# EasyEDA Pro project ProPrj_MotorHall.epro

# Schematic Schematic1
Board Name: Board1; Create Date: 2024-10-31; Page Name: P1; Project Name: MotorHall; Schematic Name: Schematic1; Update Date: 2024-10-31; Company: 嘉立创EDA; Page Size: A4; Version: V1.0
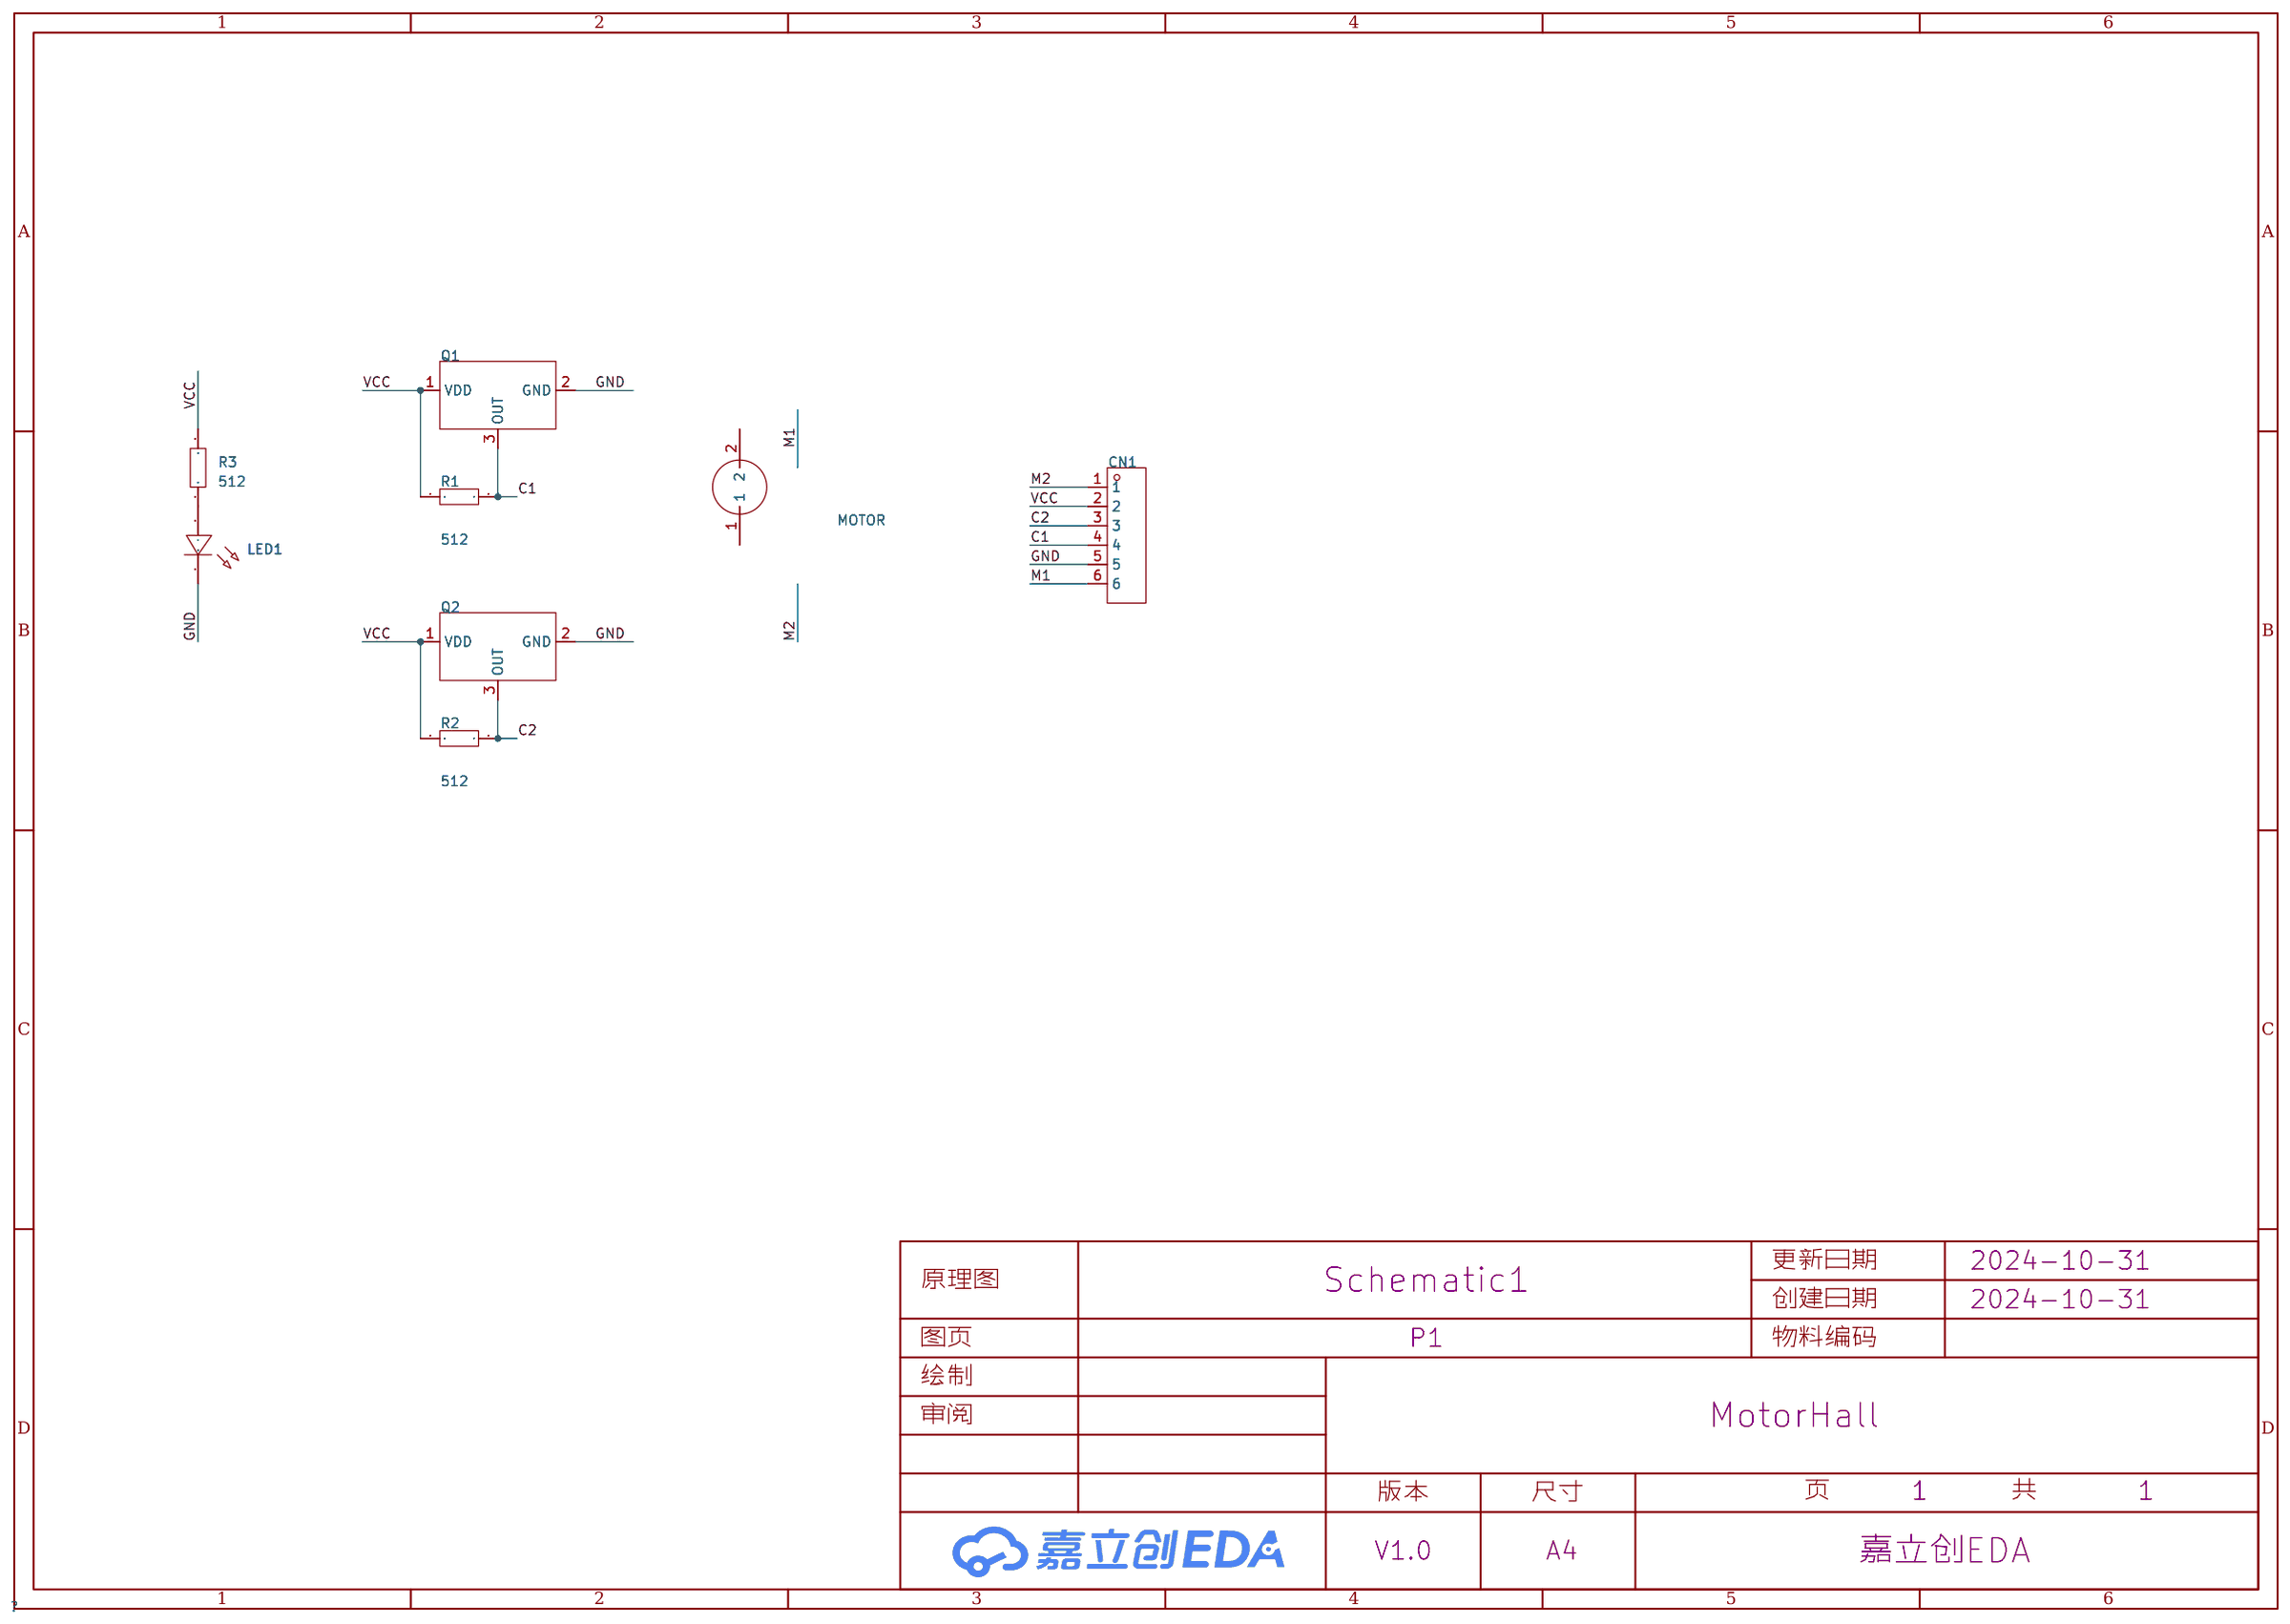
[diagram p0: schematic sheet]

## Parts
CN1  HC-1.25-6AW  [CONN-TH_6P-P1.25_HCTL_HC-1.25-6AW]
LED1  -  [LED_0603]
MOTOR  -  [N20电机座]
Q1  US1881KUA-AAA-000-BU  [TO-92-3_L4.1-W1.6-P1.27-L]
Q2  US1881KUA-AAA-000-BU  [TO-92-3_L4.1-W1.6-P1.27-L]
R1  512  [R0603]
R2  512  [R0603]
R3  512  [R0603]

## Library data of the parts
CN1 = HC-1.25-6AW: 插针结构:1x6P;间距:1.25mm;安装方式:弯插;参考系列:-;总PIN数:6P;排数:1;每排PIN数:6;行距:-;额定电流:1A;触头材质:黄铜;触头镀层:锡;工作温度范围:-25℃~+85℃;; LCSC Part Name: 1x6P 间距:1.25mm 弯插; Supplier Part: C2845539; Manufacturer: HCTL(华灿天禄); Supplier Footprint: 弯插,P=1.25mm; JLCPCB Part Class: 扩展库; Datasheet: https://atta.szlcsc.com/upload/public/pdf/source/20230707/04F6BEA69F699E7BB6558EF06AF1DC24.pdf; Supplier: LCSC; Pins Structure: 1x6P; Pitch: 1.25mm; Mounting Style: 弯插; Number of Pins: 6P; Number of Rows: 1; Number of PINs Per Row: 6; Current Rating (Max): 1A; Contact Material: 黄铜; Contact Plating: 锡; Operating Temperature Range: -25℃~+85℃
LED1 = LED_0603-B: Supplier Footprint: 0603
MOTOR = N20电机
Q1 Q2 = US1881KUA-AAA-000-BU: 工作点(Gs):95Gs;释放点(Gs):-95Gs;; Supplier Part: C17199063; Manufacturer: Melexis(比利时迈来芯); Supplier Footprint: TO-92-3; JLCPCB Part Class: 扩展库; Datasheet: https://atta.szlcsc.com/upload/public/pdf/source/20210430/5B613BCA688C7C562539A6C7AF24464E.pdf; Supplier: LCSC; supply voltage: 3.5V~24V; Operation Points: 95Gs; Release Points: -95Gs; Operating Temperature: -40℃~+125℃
R1-R3 = Res_0603: Supplier Footprint: 0603

## Nets
GND: CN1.5 LED1.1(C) Q1.2(GND) Q2.2(GND)
VCC: CN1.2 Q1.1(VDD) Q2.1(VDD) R1.1 R2.1 R3.2
C1: CN1.4 Q1.3(OUT) R1.2
C2: CN1.3 Q2.3(OUT) R2.2
M1: CN1.6
M2: CN1.1
$1N567: LED1.2(A) R3.1

Not connected (* = marked no-connect by the designer): MOTOR 1 2

# Schematic Schematic2
Board Name: V2; Create Date: 2024-11-01; Page Name: P1; Project Name: MotorHall; Schematic Name: Schematic2; Update Date: 2024-11-04; Company: 嘉立创EDA; Page Size: A4; Version: V1.0
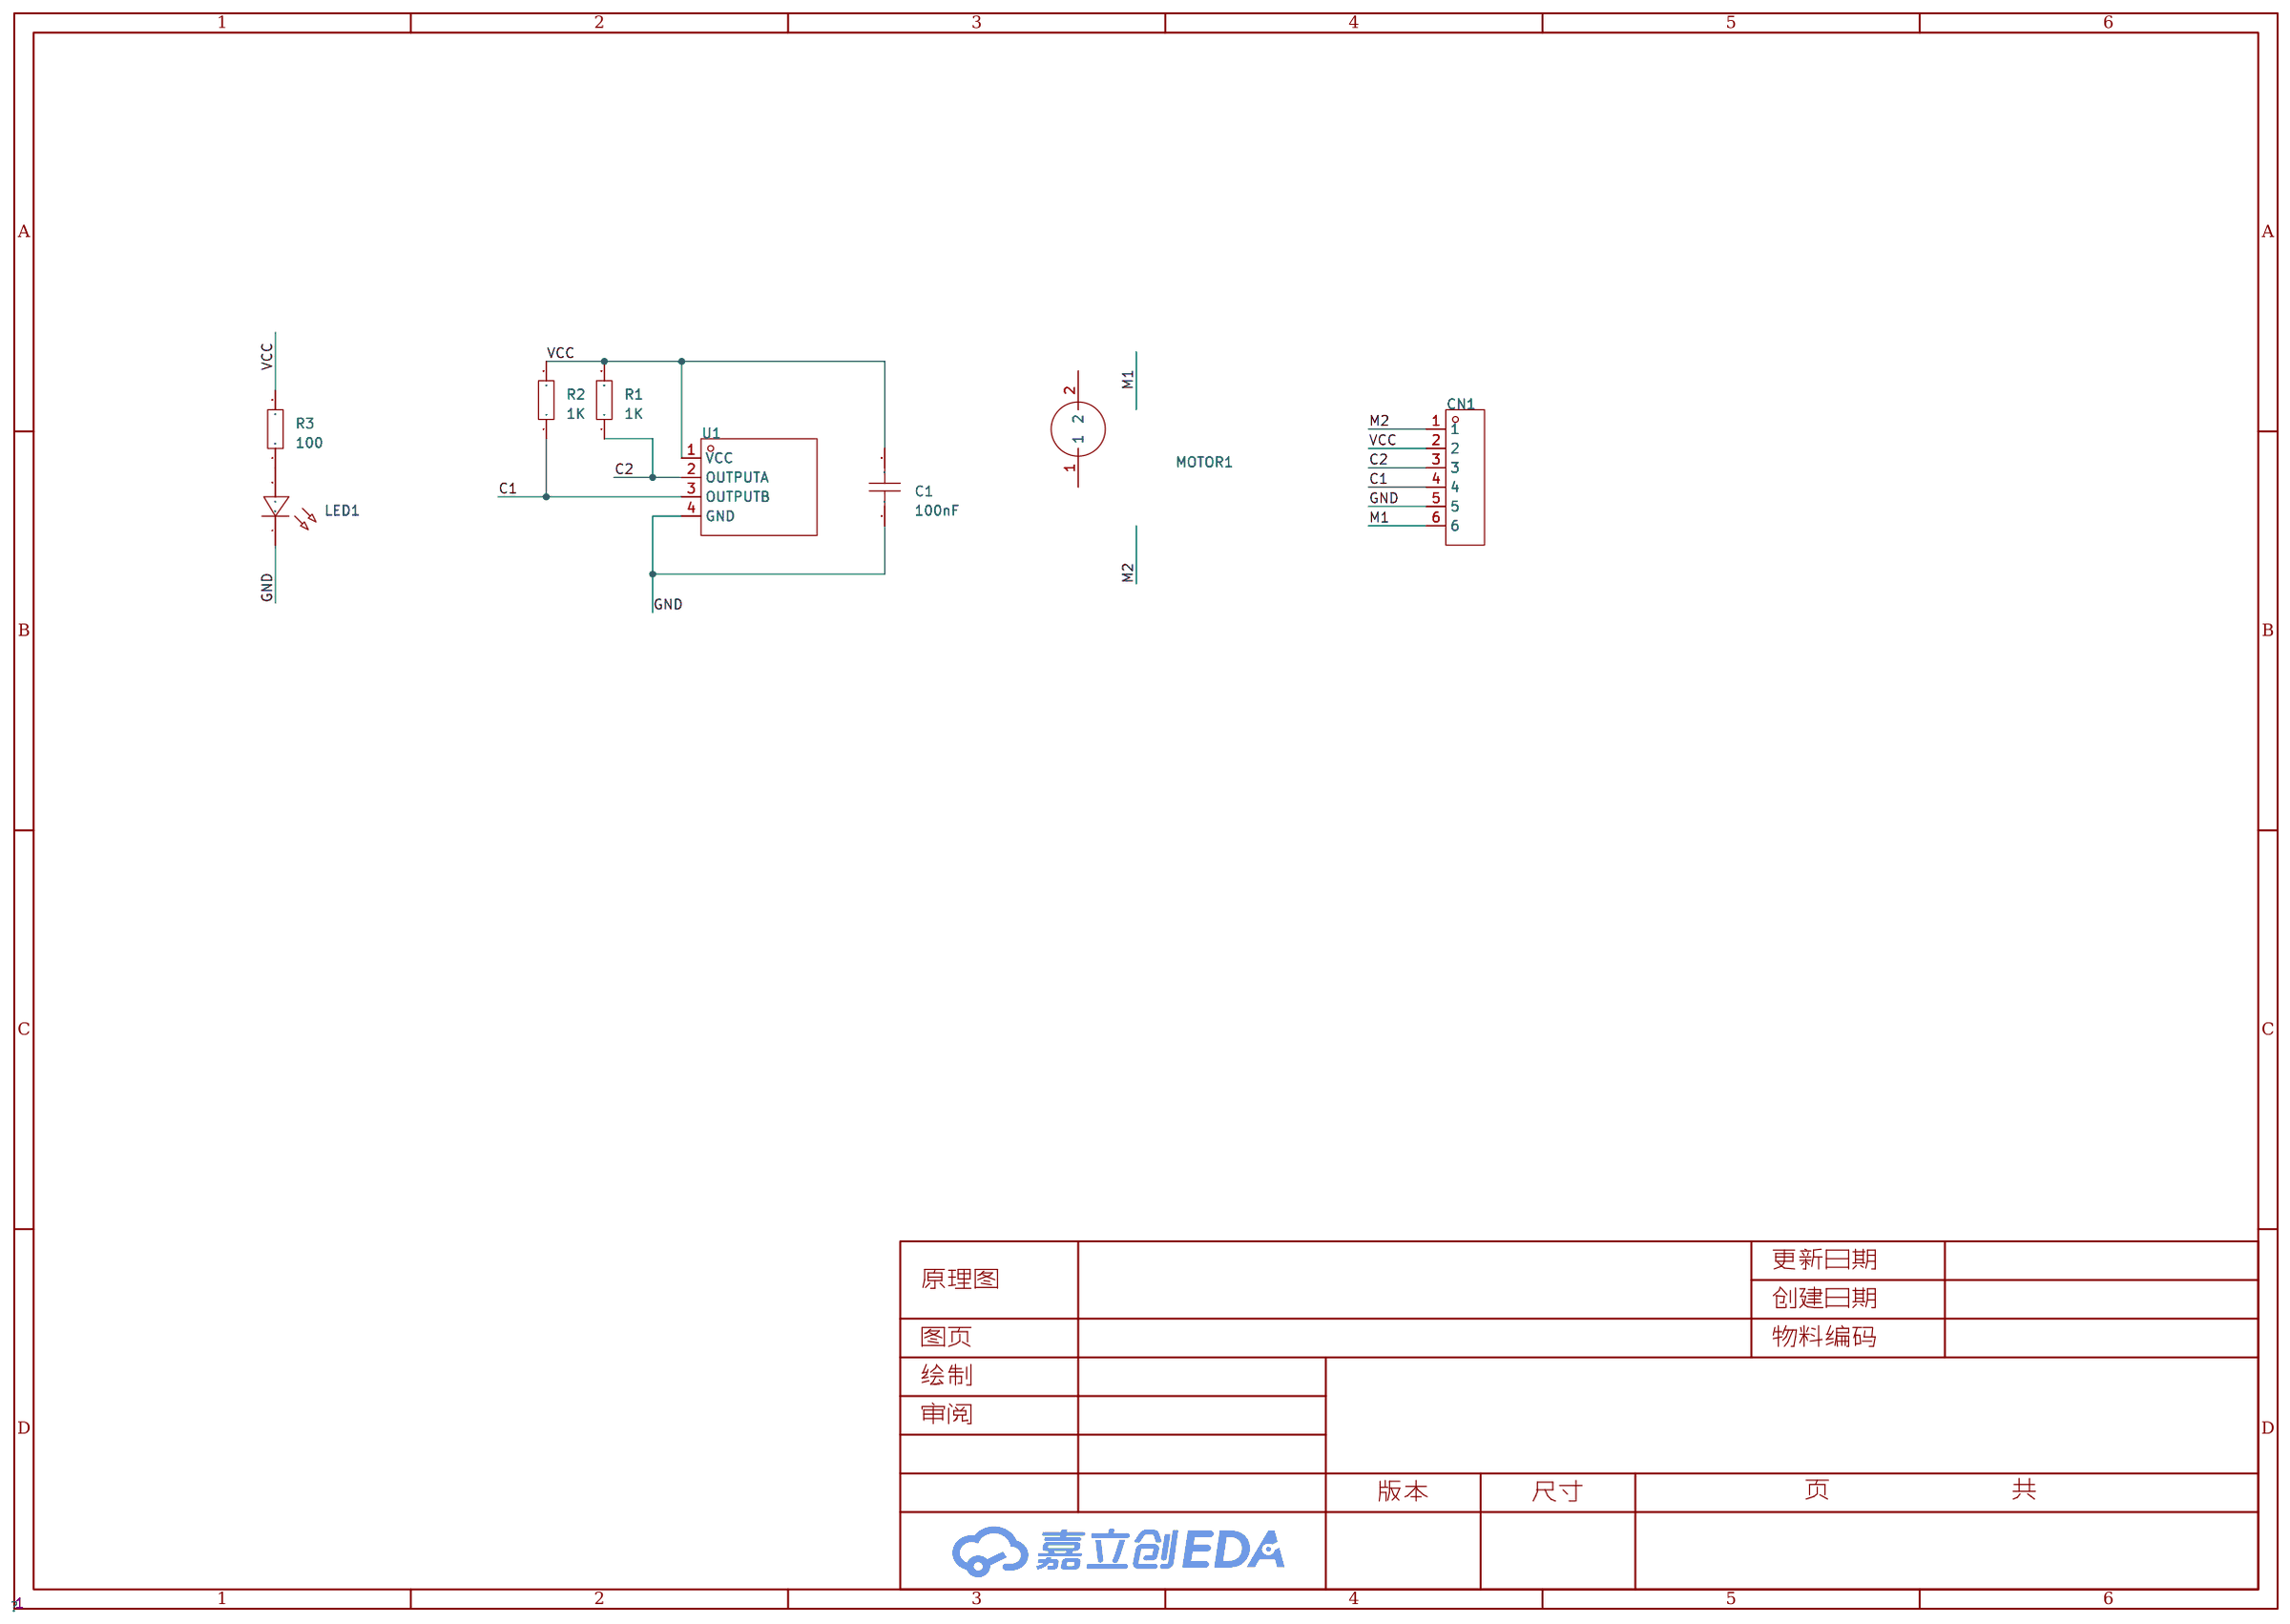
[diagram p1: schematic sheet]

## Parts
C1  100nF  [C0603]
CN1  HC-1.25-6AW  [CONN-TH_6P-P1.25_HCTL_HC-1.25-6AW]
LED1  -  [LED_0603]
MOTOR1  -  [N20电机座]
R1  1K  [R0603]
R2  1K  [R0603]
R3  100  [R0603]
U1  A1230LK-T  [SIP-4_L5.3-W1.6-P1.27-L]

## Library data of the parts
C1 = CAP_0603: Supplier Footprint: 0603
CN1 = HC-1.25-6AW: 插针结构:1x6P;间距:1.25mm;安装方式:弯插;参考系列:-;总PIN数:6P;排数:1;每排PIN数:6;行距:-;额定电流:1A;触头材质:黄铜;触头镀层:锡;工作温度范围:-25℃~+85℃;; LCSC Part Name: 1x6P 间距:1.25mm 弯插; Supplier Part: C2845539; Manufacturer: HCTL(华灿天禄); Supplier Footprint: 弯插,P=1.25mm; JLCPCB Part Class: 扩展库; Datasheet: https://atta.szlcsc.com/upload/public/pdf/source/20230707/04F6BEA69F699E7BB6558EF06AF1DC24.pdf; Supplier: LCSC; Pins Structure: 1x6P; Pitch: 1.25mm; Mounting Style: 弯插; Number of Pins: 6P; Number of Rows: 1; Number of PINs Per Row: 6; Current Rating (Max): 1A; Contact Material: 黄铜; Contact Plating: 锡; Operating Temperature Range: -25℃~+85℃
LED1 = LED_0603-B: Supplier Footprint: 0603
MOTOR1 = N20电机
R1-R3 = Res_0603: Supplier Footprint: 0603
U1 = A1230LK-T: 工作点(Gs):30Gs;释放点(Gs):-30Gs;; LCSC Part Name: 霍尔效应开关; Supplier Part: C696500; Manufacturer: ALLEGRO(美国埃戈罗); Supplier Footprint: SIP-4; JLCPCB Part Class: 扩展库; Datasheet: https://atta.szlcsc.com/upload/public/pdf/source/20200706/C696500_0E6C849013AAD831CBB5913B844409D4.pdf; Supplier: LCSC; supply voltage: 3.3V~18V; Operation Points: 30Gs; Release Points: -30Gs; Operating Temperature: -40℃~+150℃

## Nets
GND: C1.1 CN1.5 LED1.1(C) U1.4(GND)
VCC: C1.2 CN1.2 R1.2 R2.2 R3.2 U1.1(VCC)
C1: CN1.4 R2.1 U1.3(OUTPUTB)
C2: CN1.3 R1.1 U1.2(OUTPUTA)
M1: CN1.6
M2: CN1.1
$1N393: LED1.2(A) R3.1

Not connected (* = marked no-connect by the designer): MOTOR1 1 2

# Board PCB1
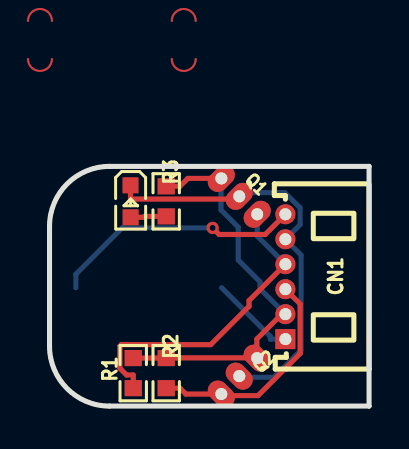
[diagram p2: board, top side]
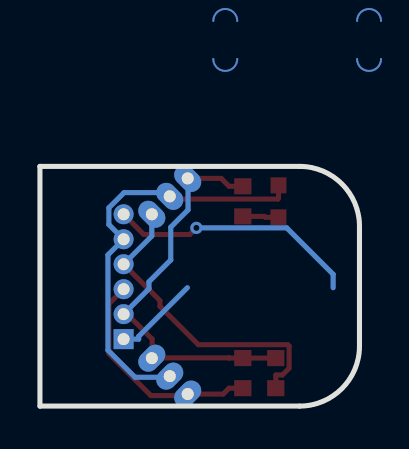
[diagram p3: board, bottom side, seen from below]

Outline 16 x 12 mm; copper layers: Top Layer, Bottom Layer. Coordinates in mm from the lower left corner of the outline.
Outline path: 0,9 0,3 arc(0.88,0.88) 3,0 16,0 16,12 3,12 arc(0.88,11.12) 0,9
Stack: Top Layer 0.035mm / Dielectric1 1.51mm FR4 er 4.5 / Bottom Layer 0.035mm

## Design rules (mm)
template: 自定义配置
spacing copperThickness1oz (default): track to track 0.102, other pairs 0 to 0.3
spacing copperThickness2oz: track to track 0.203, other pairs 0.152 to 0.3
track width copperThickness1oz (default): min 0.127, default 0.254, max 2.54
track width copperThickness2oz: min 0.203, default 0.254, max 2.54
differential pair differentialPair (default): width min 0.127, default 0.254, max 2.54; gap min 0.152, default 0.152
via viaSize (default): diameter min 0.5, default 0.61, max 10; hole min 0.3, default 0.305, max 6.3

## Placement (name value [footprint] x y rotation side)
CN1  HC-1.25-6AW  [CONN-TH_6P-P1.25_HCTL_HC-1.25-6AW]  11.81 6.48 90 top
LED1  -  [LED_0603]  4.06 10.2 270 top
MOTOR  -  [N20电机座]  5 6 180 top
Q1  US1881KUA-AAA-000-BU  [TO-92-3_L4.1-W1.6-P1.27-L]  9.5 10.5 315 top
Q2  US1881KUA-AAA-000-BU  [TO-92-3_L4.1-W1.6-P1.27-L]  9.5 1.5 225 top
R1  512  [R0603]  4.19 1.65 270 top
R2  512  [R0603]  5.84 1.65 270 top
R3  512  [R0603]  5.84 10.25 90 top

## Footprints (pads in the part's own frame, mm; a bottom-side part is the same pattern mirrored in y, then rotated)
CONN-TH_6P-P1.25_HCTL_HC-1.25-6AW
  rect 1x1 hole 0.6: 1(-3.125,0)
  round 1 hole 0.6: 2(-1.875,0) 3(-0.625,0) 4(0.625,0) 5(1.875,0) 6(3.125,0)
LED_0603
  rect 0.8x0.8 smd: 1(-0.851,-0.01) 2(0.75,-0.005)
N20电机座
  custom 1.2x3.1 hole 0.9x2.75: 1(-1.72,-12.329) 2(5.48,-12.329)
R0603
  rect 0.806x0.864 smd: 1(-0.753,0) 2(0.753,0)
TO-92-3_L4.1-W1.6-P1.27-L
  oval 1x1.5 hole 0.6: 1(-1.27,0) 2(0,0) 3(1.27,0)

## Nets
GND: CN1.5 LED1.1 Q1.2 Q2.2
VCC: CN1.2 Q1.1 Q2.1 R1.1 R2.1 R3.2
C1: CN1.4 Q1.3 R1.2
C2: CN1.3 Q2.3 R2.2
M1: CN1.6 MOTOR.2
M2: CN1.1 MOTOR.1
$1N567: LED1.2 R3.1

## Via types
v1: diameter 0.61, hole 0.305, Top Layer to Bottom Layer, 1 via

## Routing (per net, layer and track width the routed paths; a pad name or vN(x,y) marks a point on that pad's centre or on a via; arc(x,y) is an arc through that point)
GND: length 21
  Top Layer w0.254: LED1.1 4.05,10.4 4.09,10.36 9.36,10.36 Q1.2
  Bottom Layer w0.254: Q2.2 9.56,1.44 11.24,1.44 12.6,2.8 12.6,7.57 CN1.5 12.55,9.09 12.55,9.93 11.79,10.69 9.69,10.69 Q1.2
VCC: length 20.2
  Top Layer w0.254: 4.19,2.41 6.53,2.41 6.54,2.42 10.38,2.42 ; 10.38,2.42 10.38,3.36 11.63,4.6 CN1.2 ; 10.38,2.42 10.4,2.4 ; 8.6,11.4 6.92,11.4 6.53,11 R3.2
  Bottom Layer w0.254: CN1.2 10.54,5.87 10.54,6.22 9.45,7.31 9.45,8.96 8.59,9.82 8.59,11.38 8.6,11.4
C1: length 15.8
  Top Layer w0.254: 4.19,0.9 4.19,1.56 3.86,1.56 3.52,1.89 3.52,3 3.6,3.08 8.07,3.08 9.99,5 9.99,5.28 CN1.4
  Bottom Layer w0.254: 10.4,9.6 10.4,8.51 CN1.4
C2: length 11.3
  Top Layer w0.254: CN1.3 12.55,5.12 12.55,2.63 10.44,0.53 8.68,0.53 8.6,0.6 6.82,0.6 6.53,0.9 5.84,0.9
M1: length 12.7
  Top Layer w0.254: v1(8.17,8.92) 8.49,8.59 10.8,8.59 11.81,9.6
  Bottom Layer w0.254: 1.32,5.93 1.32,6.6 3.64,8.92 v1(8.17,8.92)
M2: length 4.3
  Bottom Layer w0.254: 8.62,5.93 11.06,3.49 11.06,3.35 CN1.1
$1N567: length 1.8
  Top Layer w0.254: R3.1 4.76,9.5 4.72,9.45 4.06,9.45

# Board PCB2
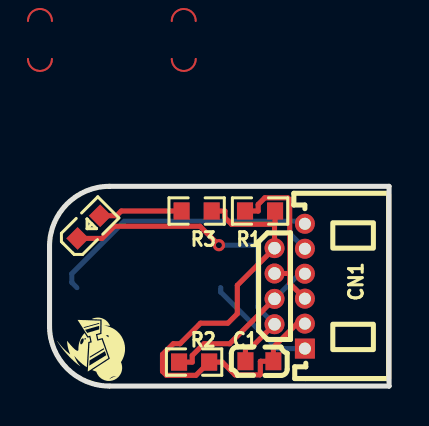
[diagram p4: board, top side]
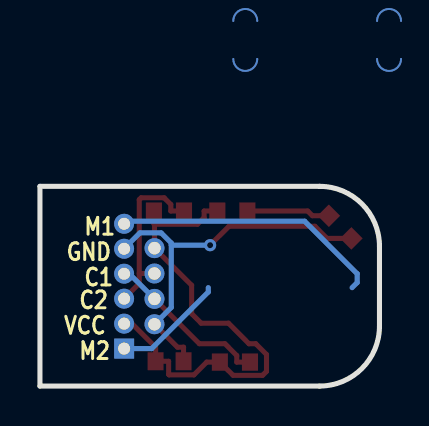
[diagram p5: board, bottom side, seen from below]

Outline 17 x 10 mm; copper layers: Top Layer, Bottom Layer. Coordinates in mm from the lower left corner of the outline.
Outline path: 0,7 arc(0.88,9.12) 3,10 17,10 17,0 3,0 arc(0.88,0.88) 0,3 0,7
Stack: Top Layer 0.035mm / Dielectric1 1.51mm FR4 er 4.5 / Bottom Layer 0.035mm

## Design rules (mm)
template: 自定义配置
spacing copperThickness1oz (default): track to track 0.102, other pairs 0.102 to 0.3
spacing copperThickness2oz: track to track 0.203, other pairs 0.152 to 0.3
track width copperThickness1oz (default): min 0.127, default 0.254, max 2.54
track width copperThickness2oz: min 0.203, default 0.254, max 2.54
differential pair differentialPair (default): width min 0.127, default 0.254, max 2.54; gap min 0.152, default 0.152
via viaSize (default): diameter min 0.5, default 0.61, max 10; hole min 0.3, default 0.305, max 6.3

## Placement (name value [footprint] x y rotation side)
C1  100nF  [C0603]  10.51 1.24 0 top
CN1  HC-1.25-6AW  [CONN-TH_6P-P1.25_HCTL_HC-1.25-6AW]  12.79 5 90 top
LED1  -  [LED_0603]  2 8 45 top
MOTOR1  -  [N20电机座]  5 5 180 top
R1  1K  [R0603]  10.54 8.76 0 top
R2  1K  [R0603]  7.24 1.2 0 top
R3  100  [R0603]  7.37 8.76 0 top
U1  A1230LK-T  [SIP-4_L5.3-W1.6-P1.27-L]  11.27 5 270 top

## Footprints (pads in the part's own frame, mm; a bottom-side part is the same pattern mirrored in y, then rotated)
C0603
  rect 0.8x0.9 smd: 1(-0.7,0) 2(0.7,0)
CONN-TH_6P-P1.25_HCTL_HC-1.25-6AW
  rect 1x1 hole 0.6: 1(-3.125,0)
  round 1 hole 0.6: 2(-1.875,0) 3(-0.625,0) 4(0.625,0) 5(1.875,0) 6(3.125,0)
LED_0603
  rect 0.8x0.8 smd: 1(-0.851,-0.01) 2(0.75,-0.005)
N20电机座
  custom 1.2x3.1 hole 0.9x2.75: 1(-1.72,-12.329) 2(5.48,-12.329)
R0603
  rect 0.806x0.864 smd: 1(-0.753,0) 2(0.753,0)
SIP-4_L5.3-W1.6-P1.27-L
  round 1 hole 0.625: 1(-1.905,0) 2(-0.635,0) 3(0.635,0) 4(1.905,0)

## Nets
GND: C1.1 CN1.5 LED1.1 U1.4
VCC: C1.2 CN1.2 R1.2 R2.2 R3.2 U1.1
C1: CN1.4 R2.1 U1.3
C2: CN1.3 R1.1 U1.2
M1: CN1.6 MOTOR1.2
M2: CN1.1 MOTOR1.1
$1N393: LED1.2 R3.1

## Via types
v1: diameter 0.61, hole 0.305, Top Layer to Bottom Layer, 1 via

## Routing (per net, layer and track width the routed paths; a pad name or vN(x,y) marks a point on that pad's centre or on a via; arc(x,y) is an arc through that point)
GND: length 19.6
  Top Layer w0.254: 11.26,3.1 10.11,1.95 9.81,1.95 9.81,1.24 ; v1(8.48,7.05) 7.53,8 3.23,8 2.62,7.39 1.4,7.39
  Bottom Layer w0.254: 10.42,7.05 10.42,3.94 11.26,3.1 ; 10.42,7.05 v1(8.48,7.05) ; 10.42,7.05 10.42,7.16 10.93,7.67 12,7.67 CN1.5
VCC: length 24.6
  Top Layer w0.254: 11.3,8.76 11.3,8.13 11.26,8.1 ; 11.26,8.1 9.11,8.1 8.78,8.43 8.78,8.76 R3.2 ; 11.26,8.1 11.26,6.91 9.4,5.04 9.4,3.62 8.93,3.15 7.56,3.15 6.53,2.12 6.19,2.12 5.66,1.58 5.66,0.73 5.85,0.54 7.33,0.54 R2.2 8.65,1.2 9.29,0.56 10.53,0.56 10.56,0.59 10.56,1.24 C1.2 11.21,1.95 12.39,3.12 CN1.2
C1: length 8.3
  Top Layer w0.254: 11.26,4.37 9.02,2.12 7.73,2.12 7.15,1.53 7.15,1.2 R2.1
  Bottom Layer w0.254: 12.79,5.63 12.52,5.63 11.26,4.37
C2: length 8.8
  Top Layer w0.254: 12.03,5.64 12.03,5.14 CN1.3 ; 12.03,5.64 11.26,5.64 ; 12.03,5.64 12.03,9.33 11.93,9.43 10.78,9.43 10.45,9.09 10.45,8.76 9.79,8.76
M1: length 13.6
  Bottom Layer w0.254: 12.79,8.13 12.66,8.25 3.74,8.25 1.12,5.62 1.12,5.18 1.37,4.93
M2: length 5.6
  Bottom Layer w0.254: 12.79,1.87 11.4,1.87 8.57,4.71 8.57,4.93
$1N393: length 4.2
  Top Layer w0.254: 2.53,8.53 3.36,8.53 3.59,8.76 R3.1

## Text on the board
Bottom Silkscreen Layer: M1 | GND | C1 | C2 | M2 | VCC
